# Altium schematic sheet keycontrol_MCU.SchDoc
size A3
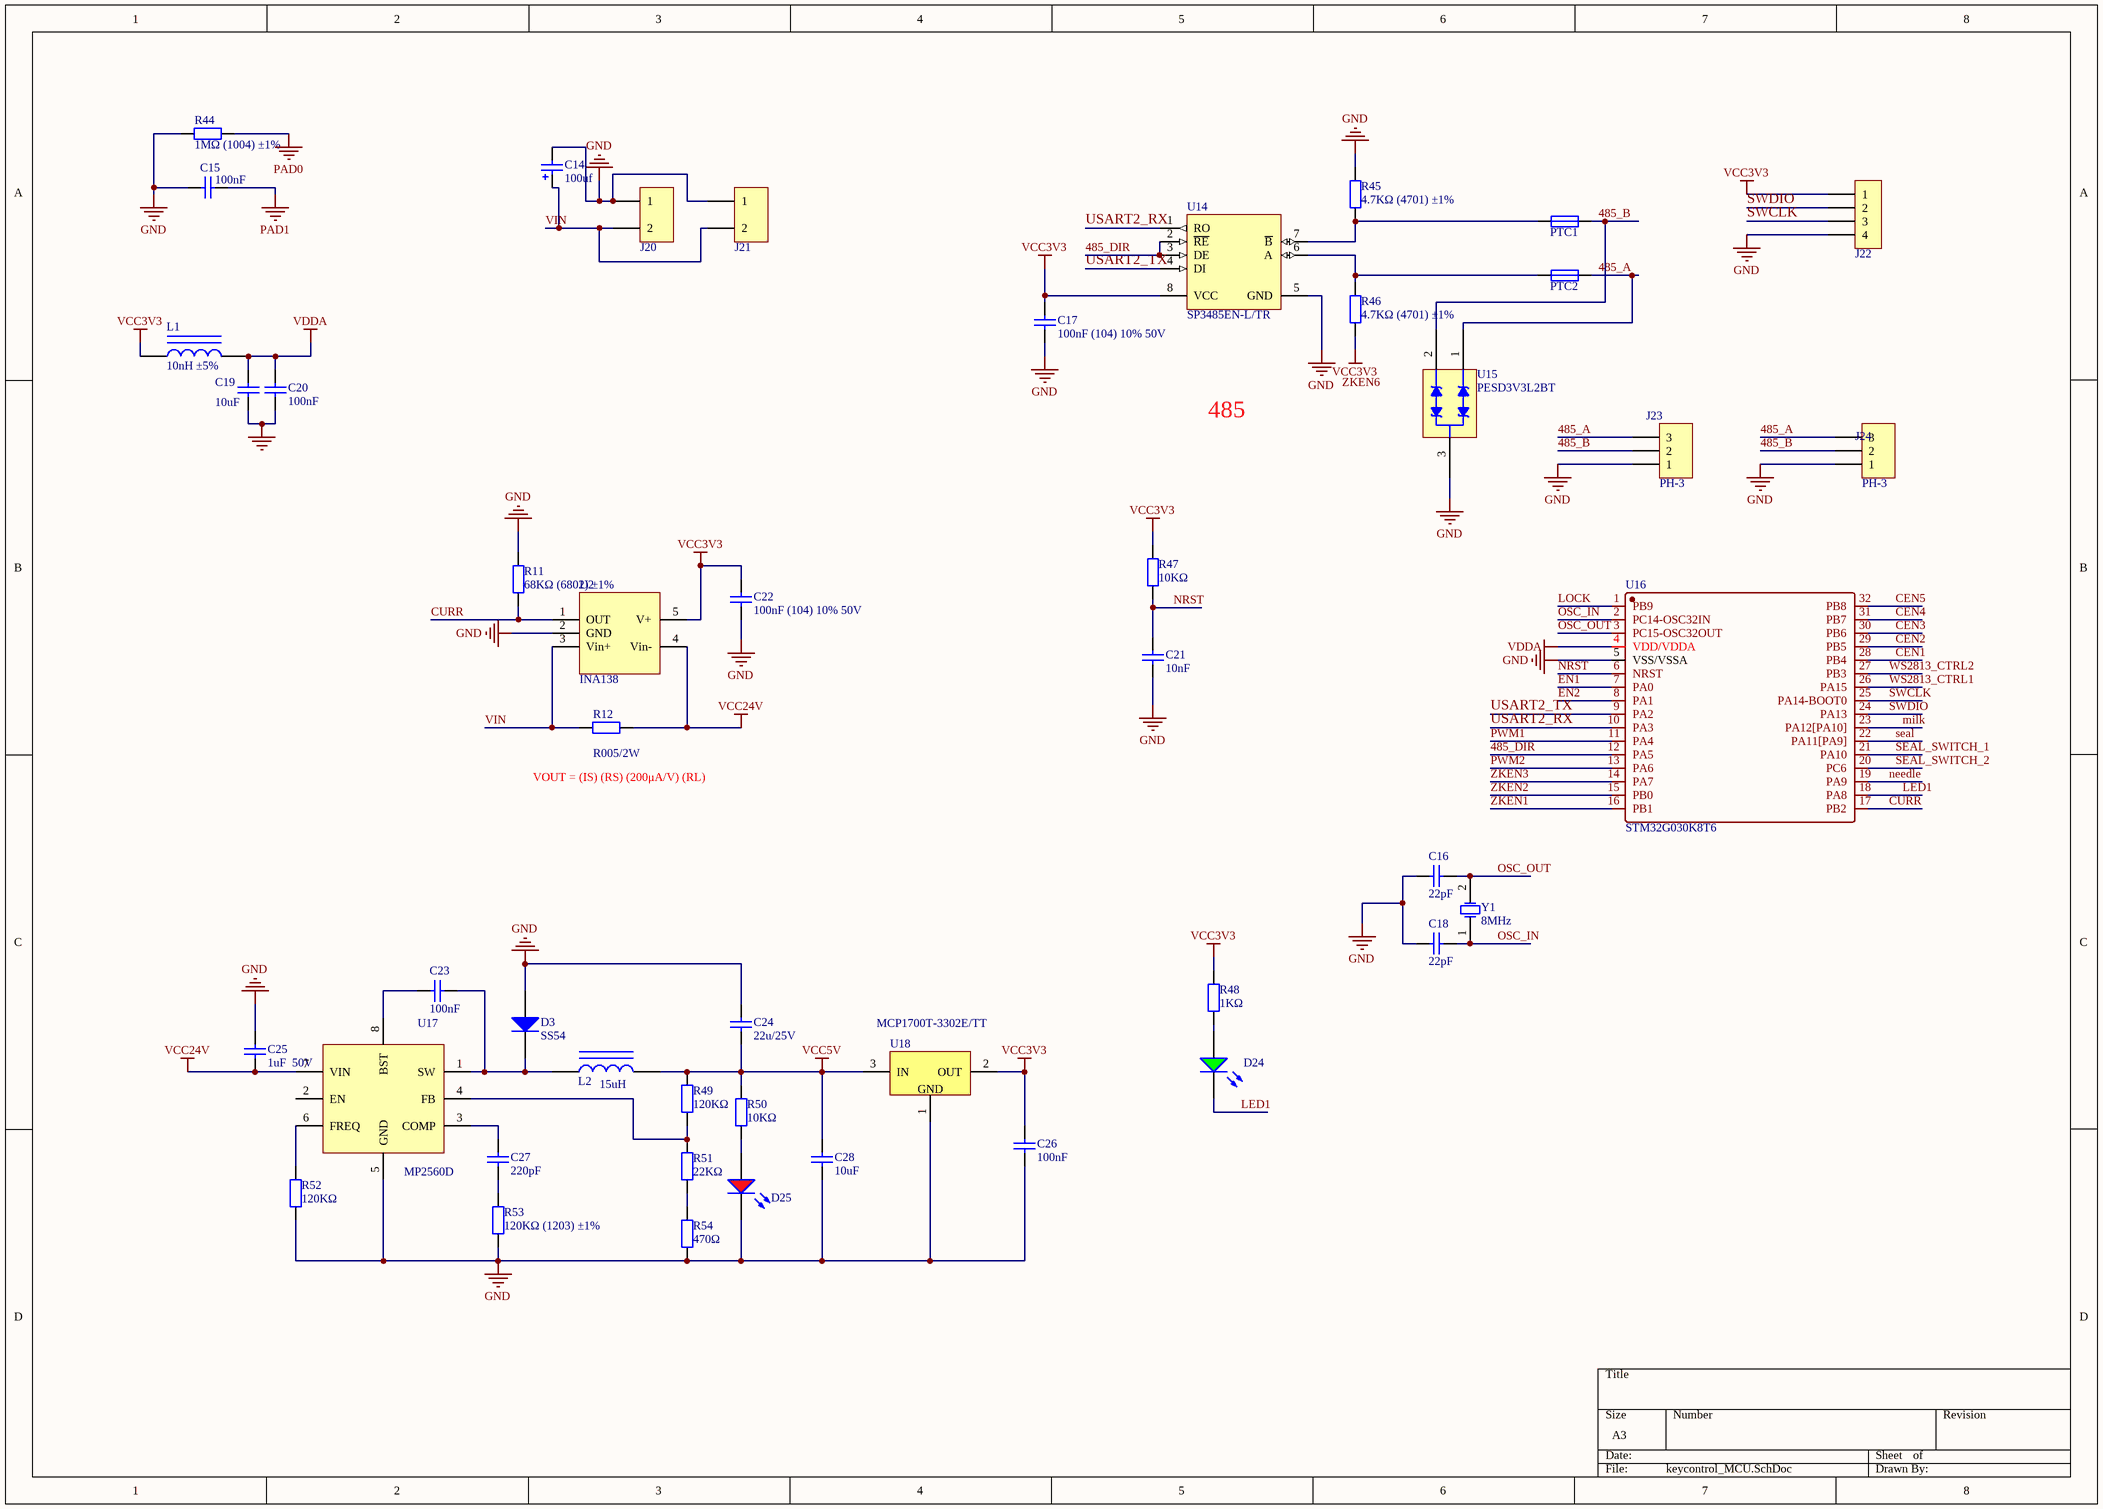
[diagram p0: keycontrol_MCU.SchDoc]

## Parts
C14  100uf  [E_6.3*5.4]
C15  100nF  [0603_C]
C16  22pF  [0603_C]
C17  100nF (104) 10% 50V  [0603_C]
C18  22pF  [0603_C]
C19  10uF  [0603_C]
C20  100nF  [0603_C]
C21  10nF  [0603_C]
C22  100nF (104) 10% 50V  [0603_C]
C23  100nF  [0603_C]
C24  22u/25V  [1206_C]
C25  1uF  50V  [0603_C]
C26  100nF  [0603_C]
C27  220pF  [0603_C]
C28  10uF  [0603_C]
D3  SS54  [SMA(DO-214AC)_S1]
D24  绿灯 0603  [0603_LED_S1]  (value not drawn)
D25  红灯 0603  [0603_LED_S1]  (value not drawn)
J20  MOTOR  [5557_a]  (value not drawn)
J21  MOTOR  [5557_a]  (value not drawn)
J22  header4  [xh-4]  (value not drawn)
J23  PH-3  [ph3-2.0]
J24  PH-3  [ph3-2.0]
L1  10nH ±5%  [0603_L]
L2  15uH  [LSMD,3.3*6.6*3mm]
PTC1  PTC  [PTC]  (value not drawn)
PTC2  PTC  [PTC]  (value not drawn)
R11  68KΩ (6802) ±1%  [0603_R]
R12  R005/2W  [2512]
R44  1MΩ (1004) ±1%  [0603_R]
R45  4.7KΩ (4701) ±1%  [0603_R]
R46  4.7KΩ (4701) ±1%  [0603_R]
R47  10KΩ  [0603_R]
R48  1KΩ  [0603_R]
R49  120KΩ  [0603_R]
R50  10KΩ  [0603_R]
R51  22KΩ  [0603_R]
R52  120KΩ  [0603_R]
R53  120KΩ (1203) ±1%  [0603_R]
R54  470Ω  [0603_R]
U2  INA138  [SOT-23-5]
U14  SP3485EN-L/TR  [SOIC-8_150mil]
U15  PESD3V3L2BT  [SOT-23(SOT-23-3)]
U16  STM32G030K8T6  [LQFP-32]
U17  MP2560D  [SOP-8_150mil]
U18  MCP1700T-3302E/TT  [SOT-23-3]
Y1  8MHz  [SMD-5032_2P]

## Nets
GND: C14.2 C15.1 C16.1 C17.1 C18.1 C19.1 C20.1 C21.1 C22.1 C24.2 C25.2 C26.1 C28.1 D3.1(A) D25.K J20.1 J21.1 J22.4 J23.1 J24.1 R11.2 R44.1 R45.2 R52.1 R53.2 R54.1 U2.2(GND) U14.5(GND) U15.3 U16.5(VSS/VSSA) U17.5(GND) U18.1
PAD0: R44.2
PAD1: C15.2
VCC3V3: C17.2 C22.2 C26.2 J22.1 L1.1 R46.1 R47.2 R48.2 U2.5(V+) U14.8(VCC) U18.2(OUT)
VCC5V: C24.1 C28.2 L2.2 R49.1 R50.2 U18.3(IN)
VCC24V: C25.1 R12.2 U2.4(Vin-) U17.7(VIN)
VDDA: C19.2 C20.2 L1.2 U16.4(VDD/VDDA)
485_A: J23.3 J24.3 PTC2.2 U15.1
485_B: J23.2 J24.2 PTC1.2 U15.2
485_DIR: U14.2(~{RE}) U14.3(DE) U16.12(PA5)
CEN1: U16.28(PB4)
CEN2: U16.29(PB5)
CEN3: U16.30(PB6)
CEN4: U16.31(PB7)
CEN5: U16.32(PB8)
CURR: R11.1 U2.1(OUT) U16.17(PB2)
EN1: U16.7(PA0)
EN2: U16.8(PA1)
LED1: D24.K U16.18(PA8)
LOCK: U16.1(PB9)
milk: U16.23(PA12[PA10])
needle: U16.19(PA9)
NRST: C21.2 R47.1 U16.6(NRST)
OSC_IN: C18.2 U16.2(PC14-OSC32IN) Y1.1(OSC1)
OSC_OUT: C16.2 U16.3(PC15-OSC32OUT) Y1.2(OSC2)
PWM1: U16.11(PA4)
PWM2: U16.13(PA6)
seal: U16.22(PA11[PA9])
SEAL_SWITCH_1: U16.21(PA10)
SEAL_SWITCH_2: U16.20(PC6)
SWCLK: J22.3 U16.25(PA14-BOOT0)
SWDIO: J22.2 U16.24(PA13)
USART2_RX: U14.1(RO) U16.10(PA3)
USART2_TX: U14.4(DI) U16.9(PA2)
VIN: C14.1 J20.2 J21.2 R12.1 U2.3(Vin+)
WS2813_CTRL1: U16.26(PA15)
WS2813_CTRL2: U16.27(PB3)
ZKEN1: U16.16(PB1)
ZKEN2: U16.15(PB0)
ZKEN3: U16.14(PA7)
NetC23_1: C23.1 U17.8(BST)
NetC23_2: C23.2 D3.2(K) L2.1 U17.1(SW)
NetC27_1: C27.1 R53.1
NetC27_2: C27.2 U17.3(COMP)
NetD24_A: D24.A R48.1
NetD25_A: D25.A R50.1
NetPTC1_1: PTC1.1 R45.1 U14.7(~{B})
NetPTC2_1: PTC2.1 R46.2 U14.6(A)
NetR49_2: R49.2 R51.2 U17.4(FB)
NetR51_1: R51.1 R54.2
NetR52_2: R52.2 U17.6(FREQ)

Not connected (* = marked no-connect by the designer): U17 2(EN)

## Notes on the sheet
- 485
- (near R12) VOUT = (IS) (RS) (200μA/V) (RL)
- Labels drawn without touching a wire or pin: ZKEN6
- (in symbol MCP1700T-3302E/TT LDO 3.3V) GND /

## Library data of the parts
C14 = C
C15 C17 C20 C22 C23 C26 = 0603 100nF (104) 10% 50V: 贴片电容; ComponentLink1Description: 供应商链接; ComponentLink1URL: http://www.szlcsc.com/product/details_15331.html; Package: 0603; Supplier: LC; SuppliersPartNumber: C14663
C16 C18 = 0603 22pF (220) 5% 50V: 贴片电容; ComponentLink1Description: 供应商链接; ComponentLink1URL: http://www.szlcsc.com/product/details_2005.html; Package: 0603; Supplier: LC; SuppliersPartNumber: C1653
C19 C28 = 0603 10uF (106) 10% 10V: 贴片电容; ComponentLink1Description: 供应商链接; ComponentLink1URL: http://www.szlcsc.com/product/details_20411.html; Package: 0603; Supplier: LC; SuppliersPartNumber: C19702
C21 = 0603 10nF (103) 10% 50V: 贴片电容; ComponentLink1Description: 供应商链接; ComponentLink1URL: http://www.szlcsc.com/product/details_58143.html; Package: 0603; Supplier: LC; SuppliersPartNumber: C57112
C24 = 1206 220pF (221) 10% 50V: 贴片电容; ComponentLink1Description: 供应商链接; ComponentLink1URL: http://www.szlcsc.com/product/details_2206.html; Package: 1206; Supplier: LC; SuppliersPartNumber: C1854
C25 = 0603 1uF (105) 10% 50V: 贴片电容; ComponentLink1Description: 供应商链接; ComponentLink1URL: http://www.szlcsc.com/product/details_16531.html; Package: 0603; Supplier: LC; SuppliersPartNumber: C15849
C27 = 0603 220pF (221) 10% 50V: 贴片电容; ComponentLink1Description: 供应商链接; ComponentLink1URL: http://www.szlcsc.com/product/details_1955.html; Package: 0603; Supplier: LC; SuppliersPartNumber: C1603
D3 = SMA(DO-214AC) SS54: 二极管; ComponentLink1Description: 供应商链接; ComponentLink1URL: http://www.szlcsc.com/product/details_23178.html; Package: SMA(DO-214AC); Supplier: LC; SuppliersPartNumber: C22452
D24 = 0603 绿灯: 发光二极管; ComponentLink1Description: 供应商链接; ComponentLink1URL: http://www.szlcsc.com/product/details_73152.html; Package: 0603; Supplier: LC; SuppliersPartNumber: C72043
D25 = 0603 红灯: 发光二极管; ComponentLink1Description: 供应商链接; ComponentLink1URL: http://www.szlcsc.com/product/details_2659.html; Package: 0603; Supplier: LC; SuppliersPartNumber: C2286
J20 J21 = header2
J23 J24 = XH-3
L1 = 0603 10nH 5%: 贴片电感; ComponentLink1Description: 供应商链接; ComponentLink1URL: http://www.szlcsc.com/product/details_16347.html; Package: 0603; Supplier: LC; SuppliersPartNumber: C15666
L2 = induct: YSPI0730-150M
R11 = 0603 68KΩ (6802) 1%: 贴片电阻; ComponentLink1Description: 供应商链接; ComponentLink1URL: http://www.szlcsc.com/product/details_23958.html; Package: 0603; Supplier: LC; SuppliersPartNumber: C23231
R12 = RES
R44 = 0603 1MΩ (1004) 1%: 贴片电阻; ComponentLink1Description: 供应商链接; ComponentLink1URL: http://www.szlcsc.com/product/details_23662.html; Package: 0603; Supplier: LC; SuppliersPartNumber: C22935
R45 R46 = 0603 4.7KΩ (4701) 1%: 贴片电阻; ComponentLink1Description: 供应商链接; ComponentLink1URL: http://www.szlcsc.com/product/details_23889.html; Package: 0603; Supplier: LC; SuppliersPartNumber: C23162
R47 R50 = 0603 10KΩ (1002) 1%: 贴片电阻; ComponentLink1Description: 供应商链接; ComponentLink1URL: http://www.szlcsc.com/product/details_26547.html; Package: 0603; Supplier: LC; SuppliersPartNumber: C25804
R48 = 0603 1KΩ (1001) 1%: 贴片电阻; ComponentLink1Description: 供应商链接; ComponentLink1URL: http://www.szlcsc.com/product/details_21904.html; Package: 0603; Supplier: LC; SuppliersPartNumber: C21190
R49 R52 R53 = 0603 120KΩ (1203) 1%: 贴片电阻; ComponentLink1Description: 供应商链接; ComponentLink1URL: http://www.szlcsc.com/product/details_26551.html; Package: 0603; Supplier: LC; SuppliersPartNumber: C25808
R51 = 0603 22KΩ (2202) 1%: 贴片电阻; ComponentLink1Description: 供应商链接; ComponentLink1URL: http://www.szlcsc.com/product/details_32812.html; Package: 0603; Supplier: LC; SuppliersPartNumber: C31850
R54 = 0603 470Ω (4700) 1%: 贴片电阻; ComponentLink1Description: 供应商链接; ComponentLink1URL: http://www.szlcsc.com/product/details_23906.html; Package: 0603; Supplier: LC; SuppliersPartNumber: C23179
U2 = INA138: SOT-23-5
U14 = SP3485EN-L/TR_[C8963]: RS-485/RS-422; ComponentLink1Description: 供应商链接; ComponentLink1URL: http://www.szlcsc.com/product/details_9482.html; Package: SOIC-8; Supplier: LC; SuppliersPartNumber: C8963
U15 = PSM712-LF-T7_[C32677]: TVS; ComponentLink1Description: 供应商链接; ComponentLink1URL: http://www.szlcsc.com/product/details_33642.html; Package: SOT-23(SOT-23-3); Supplier: LC; SuppliersPartNumber: C32677
U16 = STM32G030K8T6: MCU
U17 = MP2560D: MP2560D_SOIC-8_EP_150mil
U18 = MCP1700T-3302E/TT LDO 3.3V: https://item.szlcsc.com/40034.html LDO 3.3V
Y1 = SMD-5032_2P 8MHz 20ppm 20pF: 贴片晶振; ComponentLink1Description: 供应商链接; ComponentLink1URL: http://www.szlcsc.com/product/details_117214.html; Package: SMD-5032_2P; Supplier: LC; SuppliersPartNumber: C115962